# Altium schematic sheet Amplifier_3.SchDoc
size B; SheetNumber: 7; SheetTotal: 7
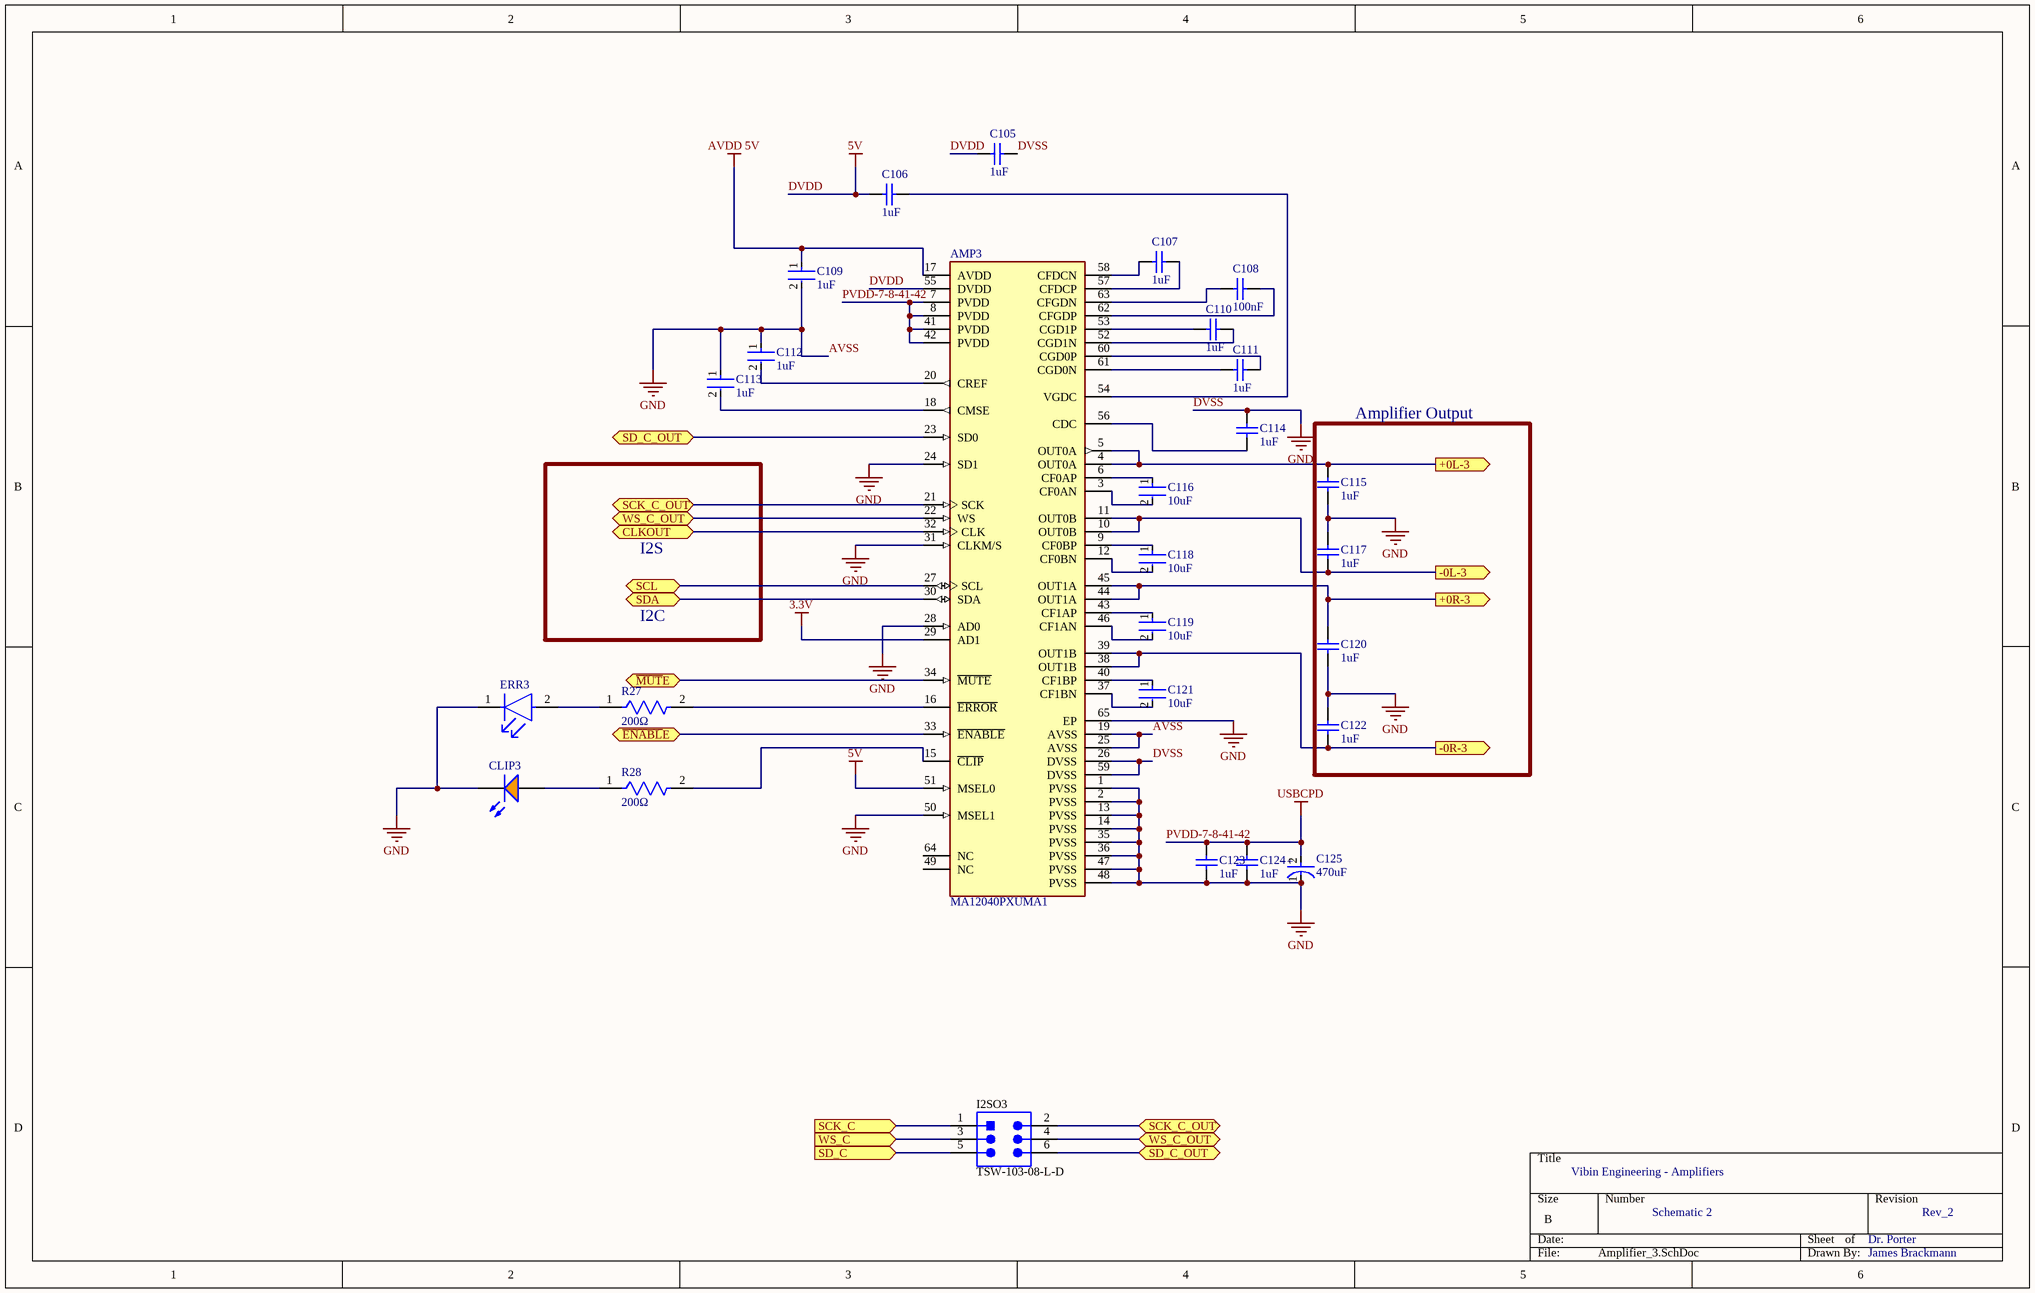
[diagram p0: Amplifier_3.SchDoc]

## Parts
AMP3  MA12040PXUMA1  [FP-PG-VQFN-64-IPC_B]
C105  1uF  [CAPC1608X90X35LL15T15]
C106  1uF  [CAPC1608X90X35LL15T15]
C107  1uF  [CAPC1608X90X35LL15T15]
C108  100nF  [CAPC1608X90X35ML10T15]
C109  1uF  [FP-GRM15-0_1-MFG]
C110  1uF  [CAPC1608X90X35LL15T15]
C111  1uF  [CAPC1608X90X35LL15T15]
C112  1uF  [FP-GRM15-0_1-MFG]
C113  1uF  [FP-GRM15-0_1-MFG]
C114  1uF  [CAPC1608X90X35LL15T15]
C115  1uF  [CAPC1608X90X35LL15T15]
C116  10uF  [FP-1210-L_3_3_0_4-W_2_5_0-MFG]
C117  1uF  [CAPC1608X90X35LL15T15]
C118  10uF  [FP-1210-L_3_3_0_4-W_2_5_0-MFG]
C119  10uF  [FP-1210-L_3_3_0_4-W_2_5_0-MFG]
C120  1uF  [CAPC1608X90X35LL15T15]
C121  10uF  [FP-1210-L_3_3_0_4-W_2_5_0-MFG]
C122  1uF  [CAPC1608X90X35LL15T15]
C123  1uF  [CAPC1608X90X35LL15T15]
C124  1uF  [CAPC1608X90X35LL15T15]
C125  470uF  [FP-OS-CON-SMT-E12-MFG]
CLIP3  TLMO1100-GS08  [VISH-TLMX1100-2_V]  (value not drawn)
ERR3  LTST-C190GKT  [FP-LTST-C190GKT-MFG]  (value not drawn)
I2SO3  TSW-103-08-L-D  [SMTC-TSW-103-08-L-D_V]
R27  200Ω  [FP-ERJ2RK-IPC_A]
R28  200Ω  [FP-ERJ2RK-IPC_A]

## Blocks framed on the sheet
Amplifier Output: C115 C117 C120 C122

## Ports
+0L-3 (out), +0R-3 (out), -0L-3 (out), -0R-3 (out), CLKOUT (bidir), SCK_C (in), SCK_C_OUT (bidir), SCL (bidir), SD_C (in), SD_C_OUT (bidir), SDA (bidir), WS_C (in), WS_C_OUT (bidir), ~{ENABL}E (bidir), ~{MUT}E (bidir)

## Nets
3.3V: AMP3.29(AD1)
AVDD 5V: AMP3.17(AVDD) C109.1
AVSS: AMP3.1(PVSS) AMP3.2(PVSS) AMP3.13(PVSS) AMP3.14(PVSS) AMP3.19(AVSS) AMP3.24(SD1) AMP3.25(AVSS) AMP3.26(DVSS) AMP3.28(AD0) AMP3.31(CLKM/S) AMP3.35(PVSS) AMP3.36(PVSS) AMP3.47(PVSS) AMP3.48(PVSS) AMP3.50(MSEL1) AMP3.59(DVSS) AMP3.65(EP) C105.1 C109.2 C112.1 C113.1 C114.1 C115.2 C117.1 C120.2 C122.1 C123.2 C124.2 C125.1(C) CLIP3.2(K) ERR3.1(C)  [also labelled DVSS, GND]
DVDD: AMP3.51(MSEL0) AMP3.55(DVDD) C105.2 C106.1  [also labelled 5V]
PVDD-7-8-41-42: AMP3.7(PVDD) AMP3.8(PVDD) AMP3.41(PVDD) AMP3.42(PVDD) C123.1 C124.1 C125.2(A)  [also labelled USBCPD]
+0L-3: AMP3.4(OUT0A) AMP3.5(OUT0A) C115.1 ; port +0L-3
+0R-3: AMP3.44(OUT1A) AMP3.45(OUT1A) C120.1 ; port +0R-3
-0L-3: AMP3.10(OUT0B) AMP3.11(OUT0B) C117.2 ; port -0L-3
-0R-3: AMP3.38(OUT1B) AMP3.39(OUT1B) C122.2 ; port -0R-3
~{ENABL}E: AMP3.33(~{ENABLE}) ; port ~{ENABL}E
~{MUT}E: AMP3.34(~{MUTE}) ; port ~{MUT}E
CLKOUT: AMP3.32(CLK) ; port CLKOUT
SCK_C: I2SO3.1 ; port SCK_C
SCK_C_OUT: AMP3.21(SCK) I2SO3.2 ; port SCK_C_OUT
SCL: AMP3.27(SCL) ; port SCL
SD_C: I2SO3.5 ; port SD_C
SD_C_OUT: AMP3.23(SD0) I2SO3.6 ; port SD_C_OUT
SDA: AMP3.30(SDA) ; port SDA
WS_C: I2SO3.3 ; port WS_C
WS_C_OUT: AMP3.22(WS) I2SO3.4 ; port WS_C_OUT
NetAMP3_3: AMP3.3(CF0AN) C116.2
NetAMP3_6: AMP3.6(CF0AP) C116.1
NetAMP3_9: AMP3.9(CF0BP) C118.1
NetAMP3_12: AMP3.12(CF0BN) C118.2
NetAMP3_15: AMP3.15(~{CLIP}) R28.2
NetAMP3_16: AMP3.16(~{ERROR}) R27.2
NetAMP3_18: AMP3.18(CMSE) C113.2
NetAMP3_20: AMP3.20(CREF) C112.2
NetAMP3_37: AMP3.37(CF1BN) C121.2
NetAMP3_40: AMP3.40(CF1BP) C121.1
NetAMP3_43: AMP3.43(CF1AP) C119.1
NetAMP3_46: AMP3.46(CF1AN) C119.2
NetAMP3_52: AMP3.52(CGD1N) C110.1
NetAMP3_53: AMP3.53(CGD1P) C110.2
NetAMP3_54: AMP3.54(VGDC) C106.2
NetAMP3_56: AMP3.56(CDC) C114.2
NetAMP3_57: AMP3.57(CFDCP) C107.1
NetAMP3_58: AMP3.58(CFDCN) C107.2
NetAMP3_60: AMP3.60(CGD0P) C111.1
NetAMP3_61: AMP3.61(CGD0N) C111.2
NetAMP3_62: AMP3.62(CFGDP) C108.1
NetAMP3_63: AMP3.63(CFGDN) C108.2
NetCLIP3_1: CLIP3.1(A) R28.1
NetERR3_2: ERR3.2(A) R27.1

Not connected (* = marked no-connect by the designer): AMP3 49(NC) 64(NC)

## Notes on the sheet
- I2S
- I2C
- Vibin Engineering - Amplifiers
- Schematic 2
- Dr. Porter
- Rev_2
- James Brackmann
- (in symbol CMP-05428-001033-1) +

## Library data of the parts
AMP3 = CMP-32833-000001-1: IC AMP CLASS D STEREO 40W 64QFN; Manufacturer: Infineon; Max Junction Temp: +150°C; Max Supply Voltage: 18V; Output Current Per Channel: 6A; Number Of Channels: 1; Min Supply Voltage: 4V; Nominal Supply Current: 6-38mA; Power At Speaker R: 20W @ 8Ω; Ambient Temperature Range High: +85°C; Ambient Temperature Range Low: 0°C; RoHS: TRUE; Temperature: -40°C to +150°C; Device Class L1: Integrated Circuits (ICs); Height: 0.9mm; Lead Free: Yes; Octopart: https://octopart.com/ma12040pxuma1-infineon-95984592; ComponentLink2URL: https://www.infineon.com/dgdl/Infineon-MA12040P-DS-v01_00-EN.pdf?fileId=5546d46264a8de7e0164b74ff0e561a2; Category: IC; Manufacturer Part Number: MA12040PXUMA1; Temperature Range High: +150°C; Ipc Land Pattern Name: QFN50P900X900X90-64; Automotive: No; Digikey Description: IC AMP CLASS D STEREO 40W 64QFN; Device Class L2: Linear ICs; Device Class L3: Amplifiers - Audio; Temperature Range Low: -40°C; Footprint Url: https://www.infineon.com/cms/en/product/packages/PG-VQFN/PG-VQFN-64-6/; ComponentLink2Description: Datasheet; Package: PG-VQFN-64
C105-C107 C110 C111 C114 C115 C117 C120 C122-C124 = CMP-2006-02298-2: C0603C105K4RACTU; Manufacturer: Kemet; Part Number: C0603C105K4RACTU
C108 = CMP-2100-03643-1: Chip Capacitor, 0.1 uF, +/- 10%, 50 V, -55 to 125 degC, 0603 (1608 Metric), RoHS, Tape and Reel              GRM188R71H104KA93D; Manufacturer: Murata; Dielectric Material: Ceramic; Voltage Rating: 50V; Dielectric: X7R; Insulation Resistance: 10GR; Case Code (Metric): 1608; Lead Free: LeadFree; Depth: 0.8mm; Number of Pins: 2; Radiation Hardening: No; Case/Package: 0603; Manufacturer URL: http://www.murata.com/; Packaging: TapeandReel; Length: 1.6mm; Contact Plating: Tin; Datasheet URL: http://psearch.en.murata.com/capacitor/product/GRM188R71H104KA93%23.pdf; Tolerance: 10%; Case Code (Imperial): 0603; Min Operating Temperature: -55degC; RoHSCompliant: true; Capacitance: 100nF; Voltage: 50V; Termination: SMD/SMT; Mount: SurfaceMount; Material: Ceramic; Package Quantity: 1; Height: 0.8mm; Thickness: 0.035inch; REACH SVHC: NoSVHC; Max Operating Temperature: 125degC; Width: 0.8mm; Package Reference: 0603; Voltage Rating (DC): 50V; Datasheet Version: 42675.0; Package Description: 2-Pin Surface Mount Device, Body 1.6 x 0.8 mm
C109 C112 C113 = CMP-2008-04556-2: CAP CER 1UF 10V X5R 0402         GRM155R61A105KE15D; Manufacturer: Murata; Material: Ceramic; Tolerance: 10%; Temperature Coefficient: 15%; Octopart: https://octopart.com/grm155r61a105ke15d-murata-197442; Manufacturer Part Number: GRM155R61A105KE15D; Lead Free: Yes; ComponentLink2Description: Datasheet; Temperature: -55°C to +85°C; Temperature Range High: +85°C; Height: 0.55mm; Capacitance: 1uF; Ipc Land Pattern Name: CAPC10050X50; ComponentLink2URL: https://search.murata.co.jp/Ceramy/image/img/A01X/G101/ENG/GRM155R61A105KE15-01A.pdf; Temperature Range Low: -55°C; Device Class L2: Capacitors; Voltage Rating: 10V; RoHS: TRUE; Device Class L1: Passive Components; Device Class L3: Ceramic Capacitors; Temperature Characteristic: X5R; Mouser Description: 0402 1 uF 10 V ±10% Tolerance X5R Surface Mount Multilayer Ceramic Capacitor; Automotive: No; Package: GRM15-0.1; Digikey Description: CAP CER 1UF 10V X5R 0402; Value: 1uF; Category: Cap
C116 C118 C119 C121 = CMP-2000-05477-2: General Purpose Ceramic Capacitor, 1210, 10uF, 10%, X5R, 15%, 25V        12103D106KAT2A; Lead Free: Lead Free; Max Operating Temperature: 85°C; REACH SVHC: No SVHC; Depth: 2.5mm; Packaging: Tape and Reel; Min Operating Temperature: -55°C; Height: 2.29mm; Construction: Flat; Case Code (Imperial): 1210; Radiation Hardening: No; Voltage: 25V; Case/Package: 1210; Series: -; Dielectric: X5R; Length: 3.2mm; Thickness: 0.11inch; Package Quantity: 1; Termination: SMD/SMT; Case Code (Metric): 3225; Voltage Rating (DC): 25V; Voltage Rating: 25V; Contact Plating: Tin; RoHS Compliant: Yes; Mount: Surface Mount; Width: 0.098inch; Capacitance: 10uF; Tolerance: 10%
C125 = CMP-05428-001033-1: Conductive Polymer Aluminum Solid Capacitors (OS-CON) 470uF ±20% 20V      20SVPK470M; ESR (Equivalent Series Resistance): 14mR; Life (Hours): 1000Hour; Capacitance: 470uF; Mount: Surface Mount; Max Operating Temperature: 125°C; Min Operating Temperature: -55°C; Case/Package: Radial; Tolerance: 20%; Voltage Rating: 20V; Packaging: Tape and Reel
CLIP3 = CMP-1666-00029-1: Orange LED, 20 mA, 2.1 V, -40 to 100 degC, 2-Pin SMD (0603), RoHS, Tape and Reel           TLMO1100-GS08; Forward Voltage: 1 V; Forward Current: 150 mA; Capacitance: -323 f; Recovery Time: 4 ns; Peak Reverse Current: 5 uA; ComponentLink1URL: http://www.vishay.com/; Width: 1.35 mm; PackageReference: 0603; Min Operating Temperature: -55 degC; Packaging: Tape and Reel; RoHSCompliant: true; ComponentLink2Description: Datasheet; PackageDescription: 2-Pin Surface Mount Device, Body 1.6 x 0.8 mm; DatasheetVersion: Rev. 2.7, 03/2016; Pins: 2; Max Operating Temperature: 150 degC; Radiation Hardening: No; Package Quantity: 3000; ComponentLink1Description: Manufacturer URL; Mount: Surface Mount; REACH SVHC: No SVHC; Length: 1.8 mm; ComponentLink2URL: http://download.siliconexpert.com/pdfs/2016/8/7/12/43/26/667/vsh_/manual/379263299541529tlmb1100.pdf; Height: 1 mm
ERR3 = CMP-22017-000005-2: LED GREEN CLEAR CHIP SMD       LTST-C190GKT; Dominant Wavelength: 569nm; Reverse Voltage: 5V; Lens Color: Colorless; Viewing Angle: 130°; Voltage: 2V; Forward Current: 30mA; Power Dissipation: 100mW; Luminous Intensity: 6mcd; Number of LEDs: 1; Forward Voltage: 2.1V; Wavelength: 565nm; Test Current: 10mA; Min Operating Temperature: -55°C; Lens Style: Clear; Mount: Surface Mount; Width: 0.8mm; Packaging: Tape and Reel; Lens Transparency: Clear; Case Code (Metric): 1608; Depth: 0.8mm; Case Code (Imperial): 0603; Case/Package: 0603; Number of Pins: 2; Max Operating Temperature: 85°C; Lead Free: Lead Free; Number of Elements: 1; Length: 1.6mm; Height: 0.8mm; Package Quantity: 1; Power Rating: 100mW; Radiation Hardening: No; Illumination Color: Green; Color: Green
I2SO3 = CMP-1024-00336-5: Male Header, Pitch 2.54 mm, 2 x 3 Position, Height 8.38 mm, Tail Length 5.08 mm, -55 to 125 degC, RoHS, Bulk; Manufacturer: Samtec; DatasheetVersion: 04/2012; ComponentLink3URL: http://suddendocs.samtec.com/prints/tsw-xxx-xx-x-x-xx-xxx-footprint.pdf; PackageReference: TSW-103-08-L-D; Mounting Technology: Through Hole; Min Operating Temperature: -55 degC; ComponentLink2Description: Datasheet; Lead Pitch: 2.54 mm; ComponentLink1Description: Manufacturer URL; Mount: Through Hole; ComponentLink1URL: http://www.samtec.com/; ComponentLink3Description: Package Specification; Max Operating Temperature: 125 degC; PackageDescription: Male Header, Pitch 2.54 mm, 2 x 3 Position, Height 8.38 mm, Tail Length 5.08 mm; ComponentLink2URL: https://datasheet.ciiva.com/25618/0900766b81154476-25618436.pdf; RoHSCompliant: true
R27 = CMP-2002-00757-2: RES SMD 200 OHM 1% 1/10W 0402      ERJ-2RKF2000X; Power Rating: 100mW; Voltage Rating (DC): 50V; Resistance: 200R; Temperature Coefficient: 100ppm/°C; RoHS Compliant: Yes; Packaging: Tape and Reel; Case Code (Metric): 1005; Package Quantity: 1; Contact Plating: Tin; Series: ERJ; Mount: Surface Mount; Lead Free: Lead Free; Min Operating Temperature: -55°C; Number of Terminations: 2; Max Power Dissipation: 100mW; Technology: THICK FILM; Voltage Rating: 50V; Case/Package: 0402; Width: 0.02inch; Termination: SMD/SMT; Military Standard: Not; Height: 0.35mm; Radiation Hardening: No; Resistance Tolerance: 1%; Length: 1mm; REACH SVHC: No SVHC; Construction: Rectangular; Depth: 0.5mm; Features: Automotive AEC-Q200; Resistor Type: Thick Film; Case Code (Imperial): 0402; Tolerance: 1%; Size Code: 0402; Max Operating Temperature: 155°C
R28 = CMP-2002-00757-2: RES SMD 200 OHM 1% 1/10W 0402    ERJ-2RKF2000X; Power Rating: 100mW; Voltage Rating (DC): 50V; Resistance: 200R; Temperature Coefficient: 100ppm/°C; RoHS Compliant: Yes; Packaging: Tape and Reel; Case Code (Metric): 1005; Package Quantity: 1; Contact Plating: Tin; Series: ERJ; Mount: Surface Mount; Lead Free: Lead Free; Min Operating Temperature: -55°C; Number of Terminations: 2; Max Power Dissipation: 100mW; Technology: THICK FILM; Voltage Rating: 50V; Case/Package: 0402; Width: 0.02inch; Termination: SMD/SMT; Military Standard: Not; Height: 0.35mm; Radiation Hardening: No; Resistance Tolerance: 1%; Length: 1mm; REACH SVHC: No SVHC; Construction: Rectangular; Depth: 0.5mm; Features: Automotive AEC-Q200; Resistor Type: Thick Film; Case Code (Imperial): 0402; Tolerance: 1%; Size Code: 0402; Max Operating Temperature: 155°C